# EasyEDA schematic Mainboard.json
TITLE: Mainboard; REV: 1.0; Date: 2017-12-06; Sheet: 2/2; Drawn By: soeren.willrodt
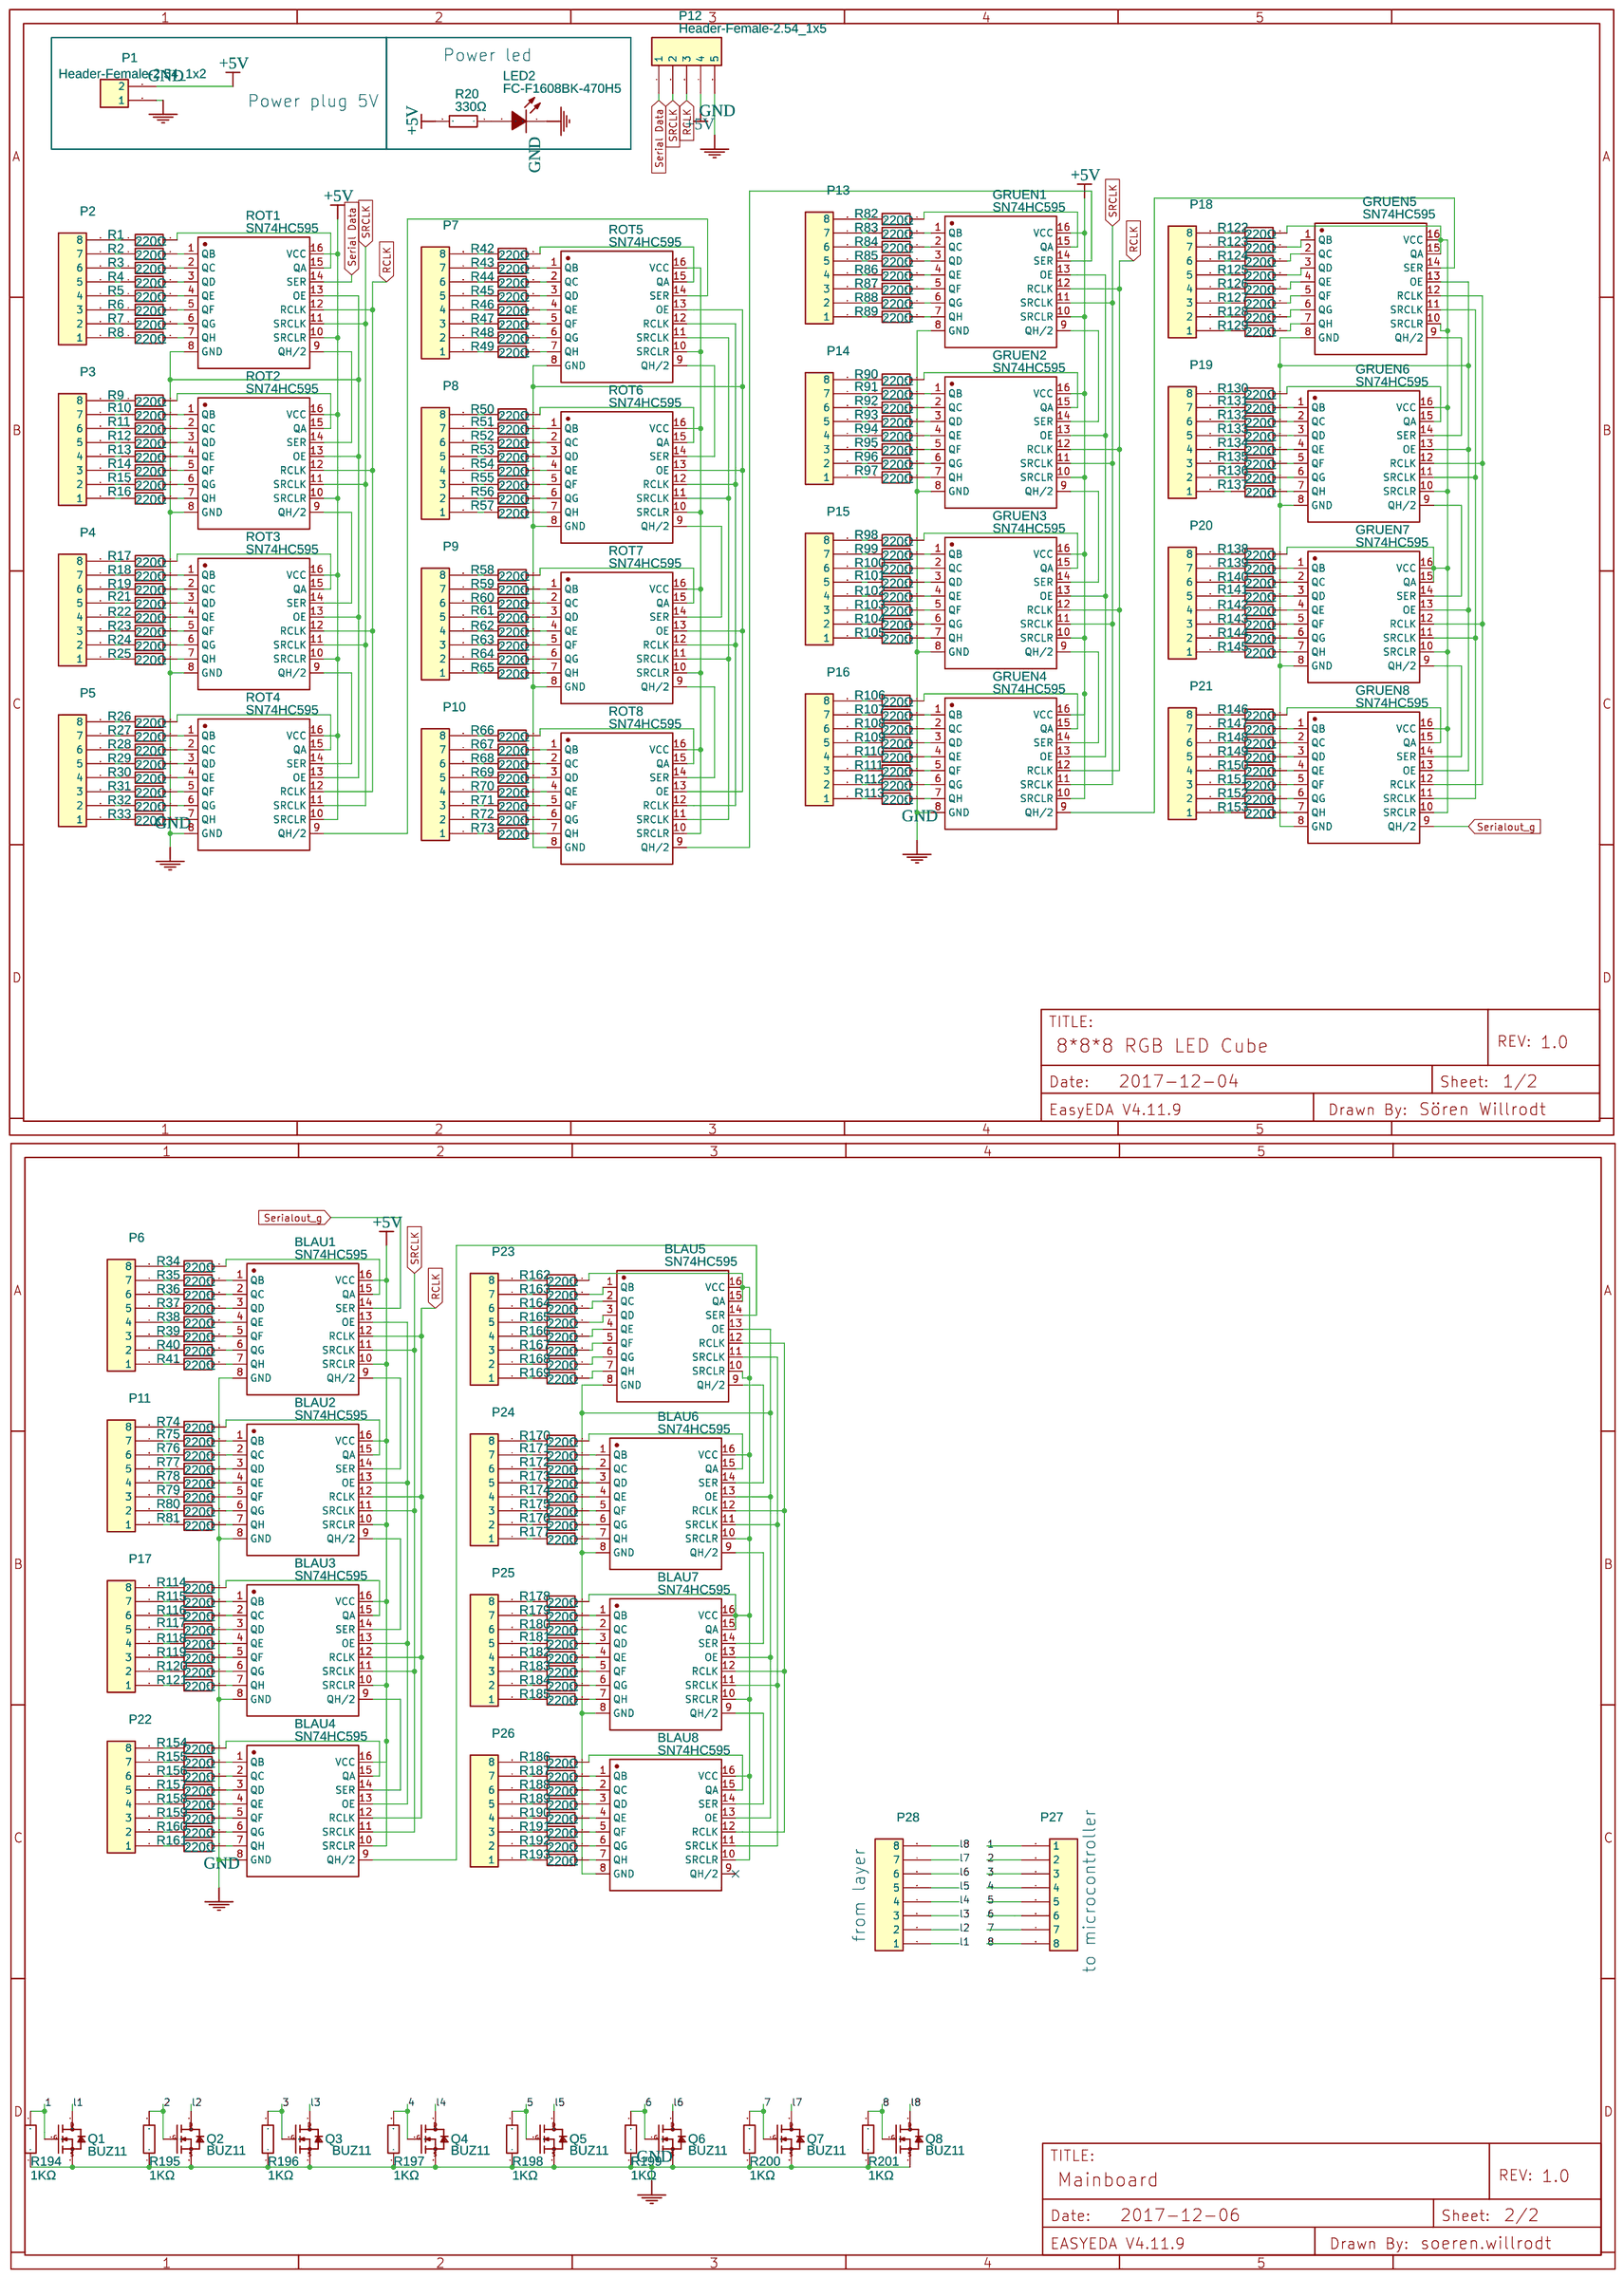
[diagram p0: schematic sheet]

## Parts
BLAU1  SN74HC595  [SOIC-16_208MIL]
BLAU2  SN74HC595  [SOIC-16_208MIL]
BLAU3  SN74HC595  [SOIC-16_208MIL]
BLAU4  SN74HC595  [SOIC-16_208MIL]
BLAU5  SN74HC595  [SOIC-16_208MIL]
BLAU6  SN74HC595  [SOIC-16_208MIL]
BLAU7  SN74HC595  [SOIC-16_208MIL]
BLAU8  SN74HC595  [SOIC-16_208MIL]
GRUEN1  SN74HC595  [SOIC-16_208MIL]
GRUEN2  SN74HC595  [SOIC-16_208MIL]
GRUEN3  SN74HC595  [SOIC-16_208MIL]
GRUEN4  SN74HC595  [SOIC-16_208MIL]
GRUEN5  SN74HC595  [SOIC-16_208MIL]
GRUEN6  SN74HC595  [SOIC-16_208MIL]
GRUEN7  SN74HC595  [SOIC-16_208MIL]
GRUEN8  SN74HC595  [SOIC-16_208MIL]
LED2  FC-F1608BK-470H5  [0603]
P1  Header-Female-2.54_1x2  [HDR-1X2/2.54]
P2  Header-Female-2.54_1x8  [HDR-8X1/2.54]
P3  Header-Female-2.54_1x8  [HDR-8X1/2.54]
P4  Header-Female-2.54_1x8  [HDR-8X1/2.54]
P5  Header-Female-2.54_1x8  [HDR-8X1/2.54]
P6  Header-Female-2.54_1x8  [HDR-8X1/2.54]
P7  Header-Female-2.54_1x8  [HDR-8X1/2.54]
P8  Header-Female-2.54_1x8  [HDR-8X1/2.54]
P9  Header-Female-2.54_1x8  [HDR-8X1/2.54]
P10  Header-Female-2.54_1x8  [HDR-8X1/2.54]
P11  Header-Female-2.54_1x8  [HDR-8X1/2.54]
P12  Header-Female-2.54_1x5  [HDR-5X1/2.54]
P13  Header-Female-2.54_1x8  [HDR-8X1/2.54]
P14  Header-Female-2.54_1x8  [HDR-8X1/2.54]
P15  Header-Female-2.54_1x8  [HDR-8X1/2.54]
P16  Header-Female-2.54_1x8  [HDR-8X1/2.54]
P17  Header-Female-2.54_1x8  [HDR-8X1/2.54]
P18  Header-Female-2.54_1x8  [HDR-8X1/2.54]
P19  Header-Female-2.54_1x8  [HDR-8X1/2.54]
P20  Header-Female-2.54_1x8  [HDR-8X1/2.54]
P21  Header-Female-2.54_1x8  [HDR-8X1/2.54]
P22  Header-Female-2.54_1x8  [HDR-8X1/2.54]
P23  Header-Female-2.54_1x8  [HDR-8X1/2.54]
P24  Header-Female-2.54_1x8  [HDR-8X1/2.54]
P25  Header-Female-2.54_1x8  [HDR-8X1/2.54]
P26  Header-Female-2.54_1x8  [HDR-8X1/2.54]
P27  Header-Female-2.54_1x8  [HDR-8X1/2.54]
P28  Header-Female-2.54_1x8  [HDR-8X1/2.54]
Q1  BUZ11  [TO-220]
Q2  BUZ11  [TO-220]
Q3  BUZ11  [TO-220]
Q4  BUZ11  [TO-220]
Q5  BUZ11  [TO-220]
Q6  BUZ11  [TO-220]
Q7  BUZ11  [TO-220]
Q8  BUZ11  [TO-220]
R1  220Ω  [2512]
R2  220Ω  [2512]
R3  220Ω  [2512]
R4  220Ω  [2512]
R5  220Ω  [2512]
R6  220Ω  [2512]
R7  220Ω  [2512]
R8  220Ω  [2512]
R9  220Ω  [2512]
R10  220Ω  [2512]
R11  220Ω  [2512]
R12  220Ω  [2512]
R13  220Ω  [2512]
R14  220Ω  [2512]
R15  220Ω  [2512]
R16  220Ω  [2512]
R17  220Ω  [2512]
R18  220Ω  [2512]
R19  220Ω  [2512]
R20  330Ω  [0603]
R21  220Ω  [2512]
R22  220Ω  [2512]
R23  220Ω  [2512]
R24  220Ω  [2512]
R25  220Ω  [2512]
R26  220Ω  [2512]
R27  220Ω  [2512]
R28  220Ω  [2512]
R29  220Ω  [2512]
R30  220Ω  [2512]
R31  220Ω  [2512]
R32  220Ω  [2512]
R33  220Ω  [2512]
R34  220Ω  [2512]
R35  220Ω  [2512]
R36  220Ω  [2512]
R37  220Ω  [2512]
R38  220Ω  [2512]
R39  220Ω  [2512]
R40  220Ω  [2512]
R41  220Ω  [2512]
R42  220Ω  [2512]
R43  220Ω  [2512]
R44  220Ω  [2512]
R45  220Ω  [2512]
R46  220Ω  [2512]
R47  220Ω  [2512]
R48  220Ω  [2512]
R49  220Ω  [2512]
R50  220Ω  [2512]
R51  220Ω  [2512]
R52  220Ω  [2512]
R53  220Ω  [2512]
R54  220Ω  [2512]
R55  220Ω  [2512]
R56  220Ω  [2512]
R57  220Ω  [2512]
R58  220Ω  [2512]
R59  220Ω  [2512]
R60  220Ω  [2512]
R61  220Ω  [2512]
R62  220Ω  [2512]
R63  220Ω  [2512]
R64  220Ω  [2512]
R65  220Ω  [2512]
R66  220Ω  [2512]
R67  220Ω  [2512]
R68  220Ω  [2512]
R69  220Ω  [2512]
R70  220Ω  [2512]
R71  220Ω  [2512]
R72  220Ω  [2512]
R73  220Ω  [2512]
R74  220Ω  [2512]
R75  220Ω  [2512]
R76  220Ω  [2512]
R77  220Ω  [2512]
R78  220Ω  [2512]
R79  220Ω  [2512]
R80  220Ω  [2512]
R81  220Ω  [2512]
R82  220Ω  [2512]
R83  220Ω  [2512]
R84  220Ω  [2512]
R85  220Ω  [2512]
R86  220Ω  [2512]
R87  220Ω  [2512]
R88  220Ω  [2512]
R89  220Ω  [2512]
R90  220Ω  [2512]
R91  220Ω  [2512]
R92  220Ω  [2512]
R93  220Ω  [2512]
R94  220Ω  [2512]
R95  220Ω  [2512]
R96  220Ω  [2512]
R97  220Ω  [2512]
R98  220Ω  [2512]
R99  220Ω  [2512]
R100  220Ω  [2512]
R101  220Ω  [2512]
R102  220Ω  [2512]
R103  220Ω  [2512]
R104  220Ω  [2512]
R105  220Ω  [2512]
R106  220Ω  [2512]
R107  220Ω  [2512]
R108  220Ω  [2512]
R109  220Ω  [2512]
R110  220Ω  [2512]
R111  220Ω  [2512]
R112  220Ω  [2512]
R113  220Ω  [2512]
R114  220Ω  [2512]
R115  220Ω  [2512]
R116  220Ω  [2512]
R117  220Ω  [2512]
R118  220Ω  [2512]
R119  220Ω  [2512]
R120  220Ω  [2512]
R121  220Ω  [2512]
R122  220Ω  [2512]
R123  220Ω  [2512]
R124  220Ω  [2512]
R125  220Ω  [2512]
R126  220Ω  [2512]
R127  220Ω  [2512]
R128  220Ω  [2512]
R129  220Ω  [2512]
R130  220Ω  [2512]
R131  220Ω  [2512]
R132  220Ω  [2512]
R133  220Ω  [2512]
R134  220Ω  [2512]
R135  220Ω  [2512]
R136  220Ω  [2512]
R137  220Ω  [2512]
R138  220Ω  [2512]
R139  220Ω  [2512]
R140  220Ω  [2512]
R141  220Ω  [2512]
R142  220Ω  [2512]
R143  220Ω  [2512]
R144  220Ω  [2512]
R145  220Ω  [2512]
R146  220Ω  [2512]
R147  220Ω  [2512]
R148  220Ω  [2512]
R149  220Ω  [2512]
R150  220Ω  [2512]
R151  220Ω  [2512]
R152  220Ω  [2512]
R153  220Ω  [2512]
R154  220Ω  [2512]
R155  220Ω  [2512]
R156  220Ω  [2512]
R157  220Ω  [2512]
R158  220Ω  [2512]
R159  220Ω  [2512]
R160  220Ω  [2512]
R161  220Ω  [2512]
R162  220Ω  [2512]
R163  220Ω  [2512]
R164  220Ω  [2512]
R165  220Ω  [2512]
R166  220Ω  [2512]
R167  220Ω  [2512]
R168  220Ω  [2512]
R169  220Ω  [2512]
R170  220Ω  [2512]
R171  220Ω  [2512]
R172  220Ω  [2512]
R173  220Ω  [2512]
R174  220Ω  [2512]
R175  220Ω  [2512]
R176  220Ω  [2512]
R177  220Ω  [2512]
R178  220Ω  [2512]
R179  220Ω  [2512]
R180  220Ω  [2512]
R181  220Ω  [2512]
R182  220Ω  [2512]
R183  220Ω  [2512]
R184  220Ω  [2512]
R185  220Ω  [2512]
R186  220Ω  [2512]
R187  220Ω  [2512]
R188  220Ω  [2512]
R189  220Ω  [2512]
R190  220Ω  [2512]
R191  220Ω  [2512]
R192  220Ω  [2512]
R193  220Ω  [2512]
R194  1KΩ  [2512]
R195  1KΩ  [2512]
R196  1KΩ  [2512]
R197  1KΩ  [2512]
R198  1KΩ  [2512]
R199  1KΩ  [2512]
R200  1KΩ  [2512]
R201  1KΩ  [2512]
ROT1  SN74HC595  [SOIC-16_208MIL]
ROT2  SN74HC595  [SOIC-16_208MIL]
ROT3  SN74HC595  [SOIC-16_208MIL]
ROT4  SN74HC595  [SOIC-16_208MIL]
ROT5  SN74HC595  [SOIC-16_208MIL]
ROT6  SN74HC595  [SOIC-16_208MIL]
ROT7  SN74HC595  [SOIC-16_208MIL]
ROT8  SN74HC595  [SOIC-16_208MIL]

## Library data of the parts
BLAU1-BLAU8 GRUEN1-GRUEN8 ROT1-ROT8 = -: Supplier: LCSC; LCSC: C6760; Manufacturer: TI; Manufacturer Part: SN74HC595ANSR
LED2 = -: Supplier: LCSC; Manufacturer: NATIONSTAR; LCSC: C89814
P1 = -: LCSC: C49661; Supplier: LCSC; Manufacturer: LCSC
P2-P11 P13-P28 = -: LCSC: C27438; Supplier: LCSC; Manufacturer: LCSC
P12 = -: LCSC: C46341; Supplier: LCSC; Manufacturer: LCSC
Q1-Q8 = -: catid: 20; sourceId: lTtPN9uQc; Manufacturer Part: ?
R1-R19 R21-R193 = -: Power: 1W; Tolerance: ±5%; Supplier: LCSC; Manufacturer: UniOhm; Manufacturer Part: 25121WJ0221T4E; LCSC: C38808
R20 = -: Power: 1/10W; Tolerance: ±1%; Supplier: LCSC; Manufacturer: UniOhm; Manufacturer Part: 0603WAF3300T5E; LCSC: C23138; LCSC Assembly: Yes
R194-R201 = -: Power: 1W; Tolerance: ±5%; Supplier: LCSC; Manufacturer: UniOhm; Manufacturer Part: 25121WJ0102T4E; LCSC: C31885

## Nets
+5V: BLAU1.10(SRCLR) BLAU1.16(VCC) BLAU2.10(SRCLR) BLAU2.16(VCC) BLAU3.10(SRCLR) BLAU3.16(VCC) BLAU4.10(SRCLR) BLAU4.16(VCC) GRUEN1.10(SRCLR) GRUEN1.16(VCC) GRUEN2.10(SRCLR) GRUEN2.16(VCC) GRUEN3.10(SRCLR) GRUEN3.16(VCC) GRUEN4.10(SRCLR) GRUEN4.16(VCC) P1.2 P12.4 R20.2 ROT1.10(SRCLR) ROT1.16(VCC) ROT2.10(SRCLR) ROT2.16(VCC) ROT3.10(SRCLR) ROT3.16(VCC) ROT4.10(SRCLR) ROT4.16(VCC)
GND: BLAU1.8(GND) BLAU2.8(GND) BLAU3.8(GND) BLAU4.8(GND) GRUEN1.8(GND) GRUEN2.8(GND) GRUEN3.8(GND) GRUEN4.8(GND) LED2.1(K) P1.1 P12.5 Q1.3(S) Q2.3(S) Q3.3(S) Q4.3(S) Q5.3(S) Q6.3(S) Q7.3(S) Q8.3(S) R194.1 R195.1 R196.1 R197.1 R198.1 R199.1 R200.1 R201.1 ROT1.8(GND) ROT1.13(OE) ROT2.8(GND) ROT2.13(OE) ROT3.8(GND) ROT3.13(OE) ROT4.8(GND) ROT4.13(OE)
1: P27.1 Q1.1(G) R194.2
2: P27.2 Q2.1(G) R195.2
3: P27.3 Q3.1(G) R196.2
4: P27.4 Q4.1(G) R197.2
5: P27.5 Q5.1(G) R198.2
6: P27.6 Q6.1(G) R199.2
7: P27.7 Q7.1(G) R200.2
8: P27.8 Q8.1(G) R201.2
l1: P28.1 Q1.2(D)
l2: P28.2 Q2.2(D)
l3: P28.3 Q3.2(D)
l4: P28.4 Q4.2(D)
l5: P28.5 Q5.2(D)
l6: P28.6 Q6.2(D)
l7: P28.7 Q7.2(D)
l8: P28.8 Q8.2(D)
RCLK: BLAU1.12(RCLK) BLAU2.12(RCLK) BLAU3.12(RCLK) BLAU4.12(RCLK) GRUEN1.12(RCLK) GRUEN2.12(RCLK) GRUEN3.12(RCLK) GRUEN4.12(RCLK) P12.3 ROT1.12(RCLK) ROT2.12(RCLK) ROT3.12(RCLK) ROT4.12(RCLK)
Serial Data: P12.1 ROT1.14(SER)
Serialout_g: BLAU1.14(SER) GRUEN8.9(QH/2)
SRCLK: BLAU1.11(SRCLK) BLAU2.11(SRCLK) BLAU3.11(SRCLK) BLAU4.11(SRCLK) GRUEN1.11(SRCLK) GRUEN2.11(SRCLK) GRUEN3.11(SRCLK) GRUEN4.11(SRCLK) P12.2 ROT1.11(SRCLK) ROT2.11(SRCLK) ROT3.11(SRCLK) ROT4.11(SRCLK)
Net-(BLAU1-1): BLAU1.1(QB) R35.2
Net-(BLAU1-2): BLAU1.2(QC) R36.2
Net-(BLAU1-3): BLAU1.3(QD) R37.2
Net-(BLAU1-4): BLAU1.4(QE) R38.2
Net-(BLAU1-5): BLAU1.5(QF) R39.2
Net-(BLAU1-6): BLAU1.6(QG) R40.2
Net-(BLAU1-7): BLAU1.7(QH) R41.2
Net-(BLAU1-9): BLAU1.9(QH/2) BLAU2.14(SER)
Net-(BLAU1-13): BLAU1.13(OE) BLAU2.13(OE) BLAU3.13(OE) BLAU4.13(OE)
Net-(BLAU1-15): BLAU1.15(QA) R34.2
Net-(BLAU2-1): BLAU2.1(QB) R75.2
Net-(BLAU2-2): BLAU2.2(QC) R76.2
Net-(BLAU2-3): BLAU2.3(QD) R77.2
Net-(BLAU2-4): BLAU2.4(QE) R78.2
Net-(BLAU2-5): BLAU2.5(QF) R79.2
Net-(BLAU2-6): BLAU2.6(QG) R80.2
Net-(BLAU2-7): BLAU2.7(QH) R81.2
Net-(BLAU2-9): BLAU2.9(QH/2) BLAU3.14(SER)
Net-(BLAU2-15): BLAU2.15(QA) R74.2
Net-(BLAU3-1): BLAU3.1(QB) R115.2
Net-(BLAU3-2): BLAU3.2(QC) R116.2
Net-(BLAU3-3): BLAU3.3(QD) R117.2
Net-(BLAU3-4): BLAU3.4(QE) R118.2
Net-(BLAU3-5): BLAU3.5(QF) R119.2
Net-(BLAU3-6): BLAU3.6(QG) R120.2
Net-(BLAU3-7): BLAU3.7(QH) R121.2
Net-(BLAU3-9): BLAU3.9(QH/2) BLAU4.14(SER)
Net-(BLAU3-15): BLAU3.15(QA) R114.2
Net-(BLAU4-1): BLAU4.1(QB) R155.2
Net-(BLAU4-2): BLAU4.2(QC) R156.2
Net-(BLAU4-3): BLAU4.3(QD) R157.2
Net-(BLAU4-4): BLAU4.4(QE) R158.2
Net-(BLAU4-5): BLAU4.5(QF) R159.2
Net-(BLAU4-6): BLAU4.6(QG) R160.2
Net-(BLAU4-7): BLAU4.7(QH) R161.2
Net-(BLAU4-9): BLAU4.9(QH/2) BLAU5.14(SER)
Net-(BLAU4-15): BLAU4.15(QA) R154.2
Net-(BLAU5-1): BLAU5.1(QB) R163.2
Net-(BLAU5-2): BLAU5.2(QC) R164.2
Net-(BLAU5-3): BLAU5.3(QD) R165.2
Net-(BLAU5-4): BLAU5.4(QE) R166.2
Net-(BLAU5-5): BLAU5.5(QF) R167.2
Net-(BLAU5-6): BLAU5.6(QG) R168.2
Net-(BLAU5-7): BLAU5.7(QH) R169.2
Net-(BLAU5-8): BLAU5.8(GND) BLAU5.13(OE) BLAU6.8(GND) BLAU6.13(OE) BLAU7.8(GND) BLAU7.13(OE) BLAU8.8(GND) BLAU8.13(OE)
Net-(BLAU5-9): BLAU5.9(QH/2) BLAU6.14(SER)
Net-(BLAU5-10): BLAU5.10(SRCLR) BLAU5.15(QA) BLAU5.16(VCC) BLAU6.10(SRCLR) BLAU6.16(VCC) BLAU7.10(SRCLR) BLAU7.15(QA) BLAU7.16(VCC) BLAU8.10(SRCLR) BLAU8.16(VCC) R162.2 R178.2
Net-(BLAU5-11): BLAU5.11(SRCLK) BLAU6.11(SRCLK) BLAU7.11(SRCLK) BLAU8.11(SRCLK)
Net-(BLAU5-12): BLAU5.12(RCLK) BLAU6.12(RCLK) BLAU7.12(RCLK) BLAU8.12(RCLK)
Net-(BLAU6-1): BLAU6.1(QB) R171.2
Net-(BLAU6-2): BLAU6.2(QC) R172.2
Net-(BLAU6-3): BLAU6.3(QD) R173.2
Net-(BLAU6-4): BLAU6.4(QE) R174.2
Net-(BLAU6-5): BLAU6.5(QF) R175.2
Net-(BLAU6-6): BLAU6.6(QG) R176.2
Net-(BLAU6-7): BLAU6.7(QH) R177.2
Net-(BLAU6-9): BLAU6.9(QH/2) BLAU7.14(SER)
Net-(BLAU6-15): BLAU6.15(QA) R170.2
Net-(BLAU7-1): BLAU7.1(QB) R179.2
Net-(BLAU7-2): BLAU7.2(QC) R180.2
Net-(BLAU7-3): BLAU7.3(QD) R181.2
Net-(BLAU7-4): BLAU7.4(QE) R182.2
Net-(BLAU7-5): BLAU7.5(QF) R183.2
Net-(BLAU7-6): BLAU7.6(QG) R184.2
Net-(BLAU7-7): BLAU7.7(QH) R185.2
Net-(BLAU7-9): BLAU7.9(QH/2) BLAU8.14(SER)
Net-(BLAU8-1): BLAU8.1(QB) R187.2
Net-(BLAU8-2): BLAU8.2(QC) R188.2
Net-(BLAU8-3): BLAU8.3(QD) R189.2
Net-(BLAU8-4): BLAU8.4(QE) R190.2
Net-(BLAU8-5): BLAU8.5(QF) R191.2
Net-(BLAU8-6): BLAU8.6(QG) R192.2
Net-(BLAU8-7): BLAU8.7(QH) R193.2
Net-(BLAU8-15): BLAU8.15(QA) R186.2
Net-(GRUEN1-1): GRUEN1.1(QB) R83.2
Net-(GRUEN1-2): GRUEN1.2(QC) R84.2
Net-(GRUEN1-3): GRUEN1.3(QD) R85.2
Net-(GRUEN1-4): GRUEN1.4(QE) R86.2
Net-(GRUEN1-5): GRUEN1.5(QF) R87.2
Net-(GRUEN1-6): GRUEN1.6(QG) R88.2
Net-(GRUEN1-7): GRUEN1.7(QH) R89.2
Net-(GRUEN1-9): GRUEN1.9(QH/2) GRUEN2.14(SER)
Net-(GRUEN1-13): GRUEN1.13(OE) GRUEN2.13(OE) GRUEN3.13(OE) GRUEN4.13(OE)
Net-(GRUEN1-14): GRUEN1.14(SER) ROT8.9(QH/2)
Net-(GRUEN1-15): GRUEN1.15(QA) R82.2
Net-(GRUEN2-1): GRUEN2.1(QB) R91.2
Net-(GRUEN2-2): GRUEN2.2(QC) R92.2
Net-(GRUEN2-3): GRUEN2.3(QD) R93.2
Net-(GRUEN2-4): GRUEN2.4(QE) R94.2
Net-(GRUEN2-5): GRUEN2.5(QF) R95.2
Net-(GRUEN2-6): GRUEN2.6(QG) R96.2
Net-(GRUEN2-7): GRUEN2.7(QH) R97.2
Net-(GRUEN2-9): GRUEN2.9(QH/2) GRUEN3.14(SER)
Net-(GRUEN2-15): GRUEN2.15(QA) R90.2
Net-(GRUEN3-1): GRUEN3.1(QB) R99.2
Net-(GRUEN3-2): GRUEN3.2(QC) R100.2
Net-(GRUEN3-3): GRUEN3.3(QD) R101.2
Net-(GRUEN3-4): GRUEN3.4(QE) R102.2
Net-(GRUEN3-5): GRUEN3.5(QF) R103.2
Net-(GRUEN3-6): GRUEN3.6(QG) R104.2
Net-(GRUEN3-7): GRUEN3.7(QH) R105.2
Net-(GRUEN3-9): GRUEN3.9(QH/2) GRUEN4.14(SER)
Net-(GRUEN3-15): GRUEN3.15(QA) R98.2
Net-(GRUEN4-1): GRUEN4.1(QB) R107.2
Net-(GRUEN4-2): GRUEN4.2(QC) R108.2
Net-(GRUEN4-3): GRUEN4.3(QD) R109.2
Net-(GRUEN4-4): GRUEN4.4(QE) R110.2
Net-(GRUEN4-5): GRUEN4.5(QF) R111.2
Net-(GRUEN4-6): GRUEN4.6(QG) R112.2
Net-(GRUEN4-7): GRUEN4.7(QH) R113.2
Net-(GRUEN4-9): GRUEN4.9(QH/2) GRUEN5.14(SER)
Net-(GRUEN4-15): GRUEN4.15(QA) R106.2
Net-(GRUEN5-1): GRUEN5.1(QB) R123.2
Net-(GRUEN5-2): GRUEN5.2(QC) R124.2
Net-(GRUEN5-3): GRUEN5.3(QD) R125.2
Net-(GRUEN5-4): GRUEN5.4(QE) R126.2
Net-(GRUEN5-5): GRUEN5.5(QF) R127.2
Net-(GRUEN5-6): GRUEN5.6(QG) R128.2
Net-(GRUEN5-7): GRUEN5.7(QH) R129.2
Net-(GRUEN5-8): GRUEN5.8(GND) GRUEN5.13(OE) GRUEN6.8(GND) GRUEN6.13(OE) GRUEN7.8(GND) GRUEN7.13(OE) GRUEN8.8(GND) GRUEN8.13(OE)
Net-(GRUEN5-9): GRUEN5.9(QH/2) GRUEN6.14(SER)
Net-(GRUEN5-10): GRUEN5.10(SRCLR) GRUEN5.15(QA) GRUEN5.16(VCC) GRUEN6.10(SRCLR) GRUEN6.16(VCC) GRUEN7.10(SRCLR) GRUEN7.15(QA) GRUEN7.16(VCC) GRUEN8.10(SRCLR) GRUEN8.16(VCC) R122.2 R138.2
Net-(GRUEN5-11): GRUEN5.11(SRCLK) GRUEN6.11(SRCLK) GRUEN7.11(SRCLK) GRUEN8.11(SRCLK)
Net-(GRUEN5-12): GRUEN5.12(RCLK) GRUEN6.12(RCLK) GRUEN7.12(RCLK) GRUEN8.12(RCLK)
Net-(GRUEN6-1): GRUEN6.1(QB) R131.2
Net-(GRUEN6-2): GRUEN6.2(QC) R132.2
Net-(GRUEN6-3): GRUEN6.3(QD) R133.2
Net-(GRUEN6-4): GRUEN6.4(QE) R134.2
Net-(GRUEN6-5): GRUEN6.5(QF) R135.2
Net-(GRUEN6-6): GRUEN6.6(QG) R136.2
Net-(GRUEN6-7): GRUEN6.7(QH) R137.2
Net-(GRUEN6-9): GRUEN6.9(QH/2) GRUEN7.14(SER)
Net-(GRUEN6-15): GRUEN6.15(QA) R130.2
Net-(GRUEN7-1): GRUEN7.1(QB) R139.2
Net-(GRUEN7-2): GRUEN7.2(QC) R140.2
Net-(GRUEN7-3): GRUEN7.3(QD) R141.2
Net-(GRUEN7-4): GRUEN7.4(QE) R142.2
Net-(GRUEN7-5): GRUEN7.5(QF) R143.2
Net-(GRUEN7-6): GRUEN7.6(QG) R144.2
Net-(GRUEN7-7): GRUEN7.7(QH) R145.2
Net-(GRUEN7-9): GRUEN7.9(QH/2) GRUEN8.14(SER)
Net-(GRUEN8-1): GRUEN8.1(QB) R147.2
Net-(GRUEN8-2): GRUEN8.2(QC) R148.2
Net-(GRUEN8-3): GRUEN8.3(QD) R149.2
Net-(GRUEN8-4): GRUEN8.4(QE) R150.2
Net-(GRUEN8-5): GRUEN8.5(QF) R151.2
Net-(GRUEN8-6): GRUEN8.6(QG) R152.2
Net-(GRUEN8-7): GRUEN8.7(QH) R153.2
Net-(GRUEN8-15): GRUEN8.15(QA) R146.2
Net-(LED2-2): LED2.2(A) R20.1
Net-(P2-1): P2.1 R8.1
Net-(P2-2): P2.2 R7.1
Net-(P2-3): P2.3 R6.1
Net-(P2-4): P2.4 R5.1
Net-(P2-5): P2.5 R4.1
Net-(P2-6): P2.6 R3.1
Net-(P2-7): P2.7 R2.1
Net-(P2-8): P2.8 R1.1
Net-(P3-1): P3.1 R16.1
Net-(P3-2): P3.2 R15.1
Net-(P3-3): P3.3 R14.1
Net-(P3-4): P3.4 R13.1
Net-(P3-5): P3.5 R12.1
Net-(P3-6): P3.6 R11.1
Net-(P3-7): P3.7 R10.1
Net-(P3-8): P3.8 R9.1
Net-(P4-1): P4.1 R25.1
Net-(P4-2): P4.2 R24.1
Net-(P4-3): P4.3 R23.1
Net-(P4-4): P4.4 R22.1
Net-(P4-5): P4.5 R21.1
Net-(P4-6): P4.6 R19.1
Net-(P4-7): P4.7 R18.1
Net-(P4-8): P4.8 R17.1
Net-(P5-1): P5.1 R33.1
Net-(P5-2): P5.2 R32.1
Net-(P5-3): P5.3 R31.1
Net-(P5-4): P5.4 R30.1
Net-(P5-5): P5.5 R29.1
Net-(P5-6): P5.6 R28.1
Net-(P5-7): P5.7 R27.1
Net-(P5-8): P5.8 R26.1
Net-(P6-1): P6.1 R41.1
Net-(P6-2): P6.2 R40.1
Net-(P6-3): P6.3 R39.1
Net-(P6-4): P6.4 R38.1
Net-(P6-5): P6.5 R37.1
Net-(P6-6): P6.6 R36.1
Net-(P6-7): P6.7 R35.1
Net-(P6-8): P6.8 R34.1
Net-(P7-1): P7.1 R49.1
Net-(P7-2): P7.2 R48.1
Net-(P7-3): P7.3 R47.1
Net-(P7-4): P7.4 R46.1
Net-(P7-5): P7.5 R45.1
Net-(P7-6): P7.6 R44.1
Net-(P7-7): P7.7 R43.1
Net-(P7-8): P7.8 R42.1
Net-(P8-1): P8.1 R57.1
Net-(P8-2): P8.2 R56.1
Net-(P8-3): P8.3 R55.1
Net-(P8-4): P8.4 R54.1
Net-(P8-5): P8.5 R53.1
Net-(P8-6): P8.6 R52.1
Net-(P8-7): P8.7 R51.1
Net-(P8-8): P8.8 R50.1
Net-(P9-1): P9.1 R65.1
Net-(P9-2): P9.2 R64.1
Net-(P9-3): P9.3 R63.1
Net-(P9-4): P9.4 R62.1
Net-(P9-5): P9.5 R61.1
Net-(P9-6): P9.6 R60.1
Net-(P9-7): P9.7 R59.1
Net-(P9-8): P9.8 R58.1
Net-(P10-1): P10.1 R73.1
Net-(P10-2): P10.2 R72.1
Net-(P10-3): P10.3 R71.1
Net-(P10-4): P10.4 R70.1
Net-(P10-5): P10.5 R69.1
Net-(P10-6): P10.6 R68.1
Net-(P10-7): P10.7 R67.1
Net-(P10-8): P10.8 R66.1
Net-(P11-1): P11.1 R81.1
Net-(P11-2): P11.2 R80.1
Net-(P11-3): P11.3 R79.1
Net-(P11-4): P11.4 R78.1
Net-(P11-5): P11.5 R77.1
Net-(P11-6): P11.6 R76.1
Net-(P11-7): P11.7 R75.1
Net-(P11-8): P11.8 R74.1
Net-(P13-1): P13.1 R89.1
Net-(P13-2): P13.2 R88.1
Net-(P13-3): P13.3 R87.1
Net-(P13-4): P13.4 R86.1
Net-(P13-5): P13.5 R85.1
Net-(P13-6): P13.6 R84.1
Net-(P13-7): P13.7 R83.1
Net-(P13-8): P13.8 R82.1
Net-(P14-1): P14.1 R97.1
Net-(P14-2): P14.2 R96.1
Net-(P14-3): P14.3 R95.1
Net-(P14-4): P14.4 R94.1
Net-(P14-5): P14.5 R93.1
Net-(P14-6): P14.6 R92.1
Net-(P14-7): P14.7 R91.1
Net-(P14-8): P14.8 R90.1
Net-(P15-1): P15.1 R105.1
Net-(P15-2): P15.2 R104.1
Net-(P15-3): P15.3 R103.1
Net-(P15-4): P15.4 R102.1
Net-(P15-5): P15.5 R101.1
Net-(P15-6): P15.6 R100.1
Net-(P15-7): P15.7 R99.1
Net-(P15-8): P15.8 R98.1
Net-(P16-1): P16.1 R113.1
Net-(P16-2): P16.2 R112.1
Net-(P16-3): P16.3 R111.1
Net-(P16-4): P16.4 R110.1
Net-(P16-5): P16.5 R109.1
Net-(P16-6): P16.6 R108.1
Net-(P16-7): P16.7 R107.1
Net-(P16-8): P16.8 R106.1
Net-(P17-1): P17.1 R121.1
Net-(P17-2): P17.2 R120.1
Net-(P17-3): P17.3 R119.1
Net-(P17-4): P17.4 R118.1
Net-(P17-5): P17.5 R117.1
Net-(P17-6): P17.6 R116.1
Net-(P17-7): P17.7 R115.1
Net-(P17-8): P17.8 R114.1
Net-(P18-1): P18.1 R129.1
Net-(P18-2): P18.2 R128.1
Net-(P18-3): P18.3 R127.1
Net-(P18-4): P18.4 R126.1
Net-(P18-5): P18.5 R125.1
Net-(P18-6): P18.6 R124.1
Net-(P18-7): P18.7 R123.1
Net-(P18-8): P18.8 R122.1
Net-(P19-1): P19.1 R137.1
Net-(P19-2): P19.2 R136.1
Net-(P19-3): P19.3 R135.1
Net-(P19-4): P19.4 R134.1
Net-(P19-5): P19.5 R133.1
Net-(P19-6): P19.6 R132.1
Net-(P19-7): P19.7 R131.1
Net-(P19-8): P19.8 R130.1
Net-(P20-1): P20.1 R145.1
Net-(P20-2): P20.2 R144.1
Net-(P20-3): P20.3 R143.1
Net-(P20-4): P20.4 R142.1
Net-(P20-5): P20.5 R141.1
Net-(P20-6): P20.6 R140.1
Net-(P20-7): P20.7 R139.1
Net-(P20-8): P20.8 R138.1
Net-(P21-1): P21.1 R153.1
Net-(P21-2): P21.2 R152.1
Net-(P21-3): P21.3 R151.1
Net-(P21-4): P21.4 R150.1
Net-(P21-5): P21.5 R149.1
Net-(P21-6): P21.6 R148.1
Net-(P21-7): P21.7 R147.1
Net-(P21-8): P21.8 R146.1
Net-(P22-1): P22.1 R161.1
Net-(P22-2): P22.2 R160.1
Net-(P22-3): P22.3 R159.1
Net-(P22-4): P22.4 R158.1
Net-(P22-5): P22.5 R157.1
Net-(P22-6): P22.6 R156.1
Net-(P22-7): P22.7 R155.1
Net-(P22-8): P22.8 R154.1
Net-(P23-1): P23.1 R169.1
Net-(P23-2): P23.2 R168.1
Net-(P23-3): P23.3 R167.1
Net-(P23-4): P23.4 R166.1
Net-(P23-5): P23.5 R165.1
Net-(P23-6): P23.6 R164.1
Net-(P23-7): P23.7 R163.1
Net-(P23-8): P23.8 R162.1
Net-(P24-1): P24.1 R177.1
Net-(P24-2): P24.2 R176.1
Net-(P24-3): P24.3 R175.1
Net-(P24-4): P24.4 R174.1
Net-(P24-5): P24.5 R173.1
Net-(P24-6): P24.6 R172.1
Net-(P24-7): P24.7 R171.1
Net-(P24-8): P24.8 R170.1
Net-(P25-1): P25.1 R185.1
Net-(P25-2): P25.2 R184.1
Net-(P25-3): P25.3 R183.1
Net-(P25-4): P25.4 R182.1
Net-(P25-5): P25.5 R181.1
Net-(P25-6): P25.6 R180.1
Net-(P25-7): P25.7 R179.1
Net-(P25-8): P25.8 R178.1
Net-(P26-1): P26.1 R193.1
Net-(P26-2): P26.2 R192.1
Net-(P26-3): P26.3 R191.1
Net-(P26-4): P26.4 R190.1
Net-(P26-5): P26.5 R189.1
Net-(P26-6): P26.6 R188.1
Net-(P26-7): P26.7 R187.1
Net-(P26-8): P26.8 R186.1
Net-(R1-2): R1.2 ROT1.15(QA)
Net-(R2-2): R2.2 ROT1.1(QB)
Net-(R3-2): R3.2 ROT1.2(QC)
Net-(R4-2): R4.2 ROT1.3(QD)
Net-(R5-2): R5.2 ROT1.4(QE)
Net-(R6-2): R6.2 ROT1.5(QF)
Net-(R7-2): R7.2 ROT1.6(QG)
Net-(R8-2): R8.2 ROT1.7(QH)
Net-(R9-2): R9.2 ROT2.15(QA)
Net-(R10-2): R10.2 ROT2.1(QB)
Net-(R11-2): R11.2 ROT2.2(QC)
Net-(R12-2): R12.2 ROT2.3(QD)
Net-(R13-2): R13.2 ROT2.4(QE)
Net-(R14-2): R14.2 ROT2.5(QF)
Net-(R15-2): R15.2 ROT2.6(QG)
Net-(R16-2): R16.2 ROT2.7(QH)
Net-(R17-2): R17.2 ROT3.15(QA)
Net-(R18-2): R18.2 ROT3.1(QB)
Net-(R19-2): R19.2 ROT3.2(QC)
Net-(R21-2): R21.2 ROT3.3(QD)
Net-(R22-2): R22.2 ROT3.4(QE)
Net-(R23-2): R23.2 ROT3.5(QF)
Net-(R24-2): R24.2 ROT3.6(QG)
Net-(R25-2): R25.2 ROT3.7(QH)
Net-(R26-2): R26.2 ROT4.15(QA)
Net-(R27-2): R27.2 ROT4.1(QB)
Net-(R28-2): R28.2 ROT4.2(QC)
Net-(R29-2): R29.2 ROT4.3(QD)
Net-(R30-2): R30.2 ROT4.4(QE)
Net-(R31-2): R31.2 ROT4.5(QF)
Net-(R32-2): R32.2 ROT4.6(QG)
Net-(R33-2): R33.2 ROT4.7(QH)
Net-(R42-2): R42.2 ROT5.15(QA)
Net-(R43-2): R43.2 ROT5.1(QB)
Net-(R44-2): R44.2 ROT5.2(QC)
Net-(R45-2): R45.2 ROT5.3(QD)
Net-(R46-2): R46.2 ROT5.4(QE)
Net-(R47-2): R47.2 ROT5.5(QF)
Net-(R48-2): R48.2 ROT5.6(QG)
Net-(R49-2): R49.2 ROT5.7(QH)
Net-(R50-2): R50.2 ROT6.15(QA)
Net-(R51-2): R51.2 ROT6.1(QB)
Net-(R52-2): R52.2 ROT6.2(QC)
Net-(R53-2): R53.2 ROT6.3(QD)
Net-(R54-2): R54.2 ROT6.4(QE)
Net-(R55-2): R55.2 ROT6.5(QF)
Net-(R56-2): R56.2 ROT6.6(QG)
Net-(R57-2): R57.2 ROT6.7(QH)
Net-(R58-2): R58.2 ROT7.15(QA)
Net-(R59-2): R59.2 ROT7.1(QB)
Net-(R60-2): R60.2 ROT7.2(QC)
Net-(R61-2): R61.2 ROT7.3(QD)
Net-(R62-2): R62.2 ROT7.4(QE)
Net-(R63-2): R63.2 ROT7.5(QF)
Net-(R64-2): R64.2 ROT7.6(QG)
Net-(R65-2): R65.2 ROT7.7(QH)
Net-(R66-2): R66.2 ROT8.15(QA)
Net-(R67-2): R67.2 ROT8.1(QB)
Net-(R68-2): R68.2 ROT8.2(QC)
Net-(R69-2): R69.2 ROT8.3(QD)
Net-(R70-2): R70.2 ROT8.4(QE)
Net-(R71-2): R71.2 ROT8.5(QF)
Net-(R72-2): R72.2 ROT8.6(QG)
Net-(R73-2): R73.2 ROT8.7(QH)
Net-(ROT1-9): ROT1.9(QH/2) ROT2.14(SER)
Net-(ROT2-9): ROT2.9(QH/2) ROT3.14(SER)
Net-(ROT3-9): ROT3.9(QH/2) ROT4.14(SER)
Net-(ROT4-9): ROT4.9(QH/2) ROT5.14(SER)
Net-(ROT5-8): ROT5.8(GND) ROT5.13(OE) ROT6.8(GND) ROT6.13(OE) ROT7.8(GND) ROT7.13(OE) ROT8.8(GND) ROT8.13(OE)
Net-(ROT5-9): ROT5.9(QH/2) ROT6.14(SER)
Net-(ROT5-10): ROT5.10(SRCLR) ROT5.16(VCC) ROT6.10(SRCLR) ROT6.16(VCC) ROT7.10(SRCLR) ROT7.16(VCC) ROT8.10(SRCLR) ROT8.16(VCC)
Net-(ROT5-11): ROT5.11(SRCLK) ROT6.11(SRCLK) ROT7.11(SRCLK) ROT8.11(SRCLK)
Net-(ROT5-12): ROT5.12(RCLK) ROT6.12(RCLK) ROT7.12(RCLK) ROT8.12(RCLK)
Net-(ROT6-9): ROT6.9(QH/2) ROT7.14(SER)
Net-(ROT7-9): ROT7.9(QH/2) ROT8.14(SER)

Not connected (* = marked no-connect by the designer): BLAU8 9(QH/2)*

## Notes on the sheet
- Power led
- Power plug 5V
- from layer
- to microcontroller
